# Altium schematic sheet compactv2-5.SchDoc
size A; SheetNumber: 3; SheetTotal: 3
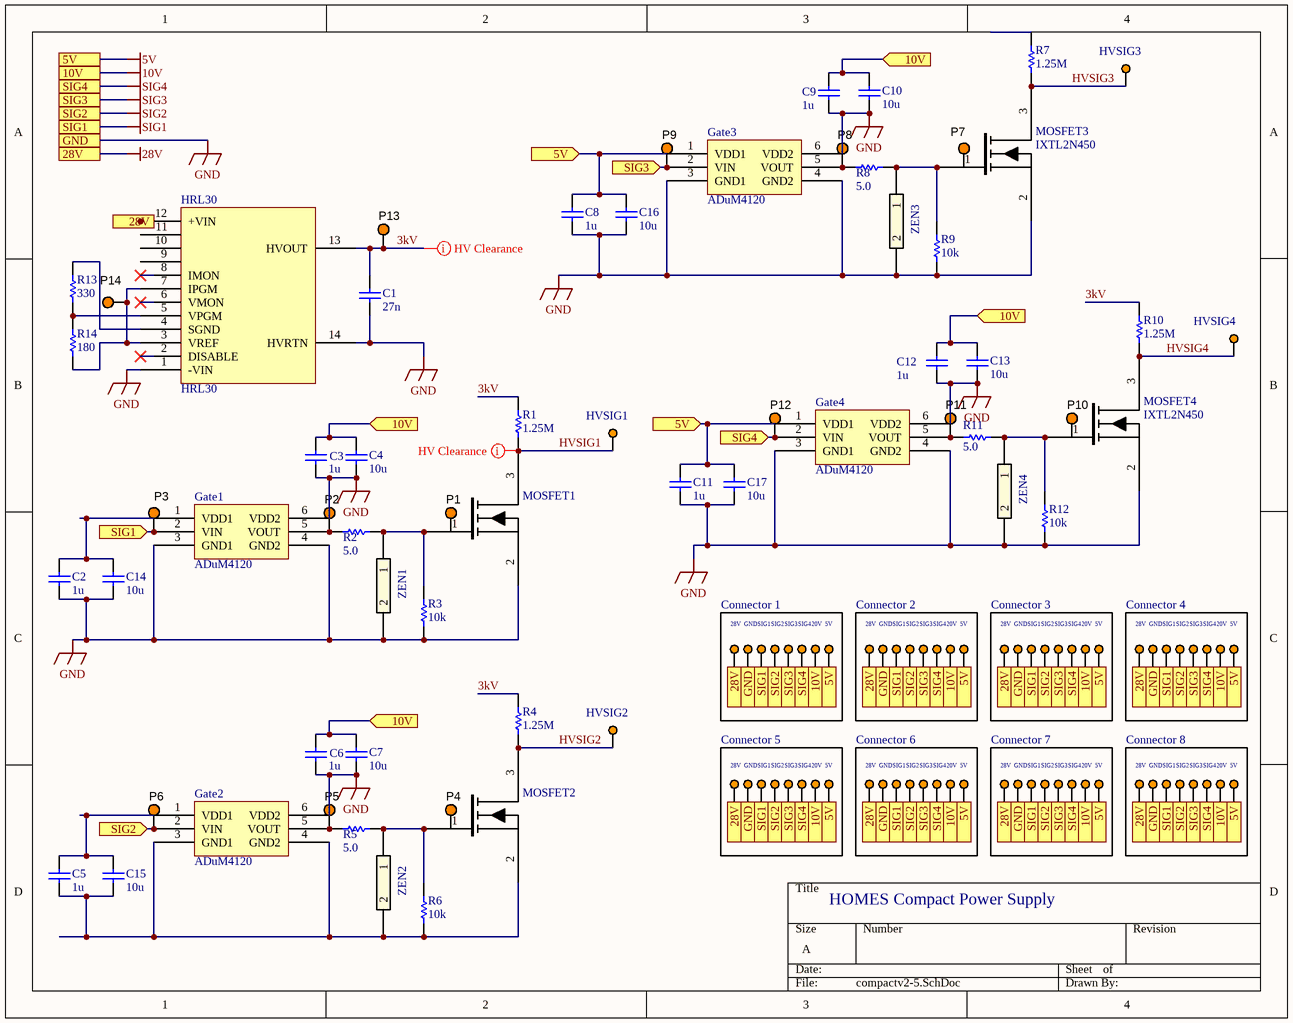
[diagram p0: compactv2-5.SchDoc]

## Parts
(Parts that share a designator on the sheet are numbered #1, #2 ... from top to bottom, then left to right.)
?#1  HVSIG4  [Via]
?#2  HVSIG1  [Via]
?#3  MOSFET1  [MOSFET]
?#4  MOSFET2  [MOSFET]
C1  27n  [HV Capacitor]
C2  1u  [1uF Ceramic Capacitor]
C3  1u  [1uF Ceramic Capacitor]
C4  10u  [10uF Ceramic Capacitor]
C5  1u  [1uF Ceramic Capacitor]
C6  1u  [1uF Ceramic Capacitor]
C7  10u  [10uF Ceramic Capacitor]
C8  1u  [1uF Ceramic Capacitor]
C9  1u  [1uF Ceramic Capacitor]
C10  10u  [10uF Ceramic Capacitor]
C11  1u  [1uF Ceramic Capacitor]
C12  1u  [1uF Ceramic Capacitor]
C13  10u  [10uF Ceramic Capacitor]
C14  10u  [10uF Ceramic Capacitor]
C15  10u  [10uF Ceramic Capacitor]
C16  10u  [10uF Ceramic Capacitor]
C17  10u  [10uF Ceramic Capacitor]
Gate1  ADuM4120  [Gate Driver]
Gate2  ADuM4120  [Gate Driver]
Gate3  ADuM4120  [Gate Driver]
Gate4  ADuM4120  [Gate Driver]
HRL30  HRL30  [Step Up Converter]
MOSFET3  IXTL2N450  [MOSFET]
MOSFET4  IXTL2N450  [MOSFET]
P1  5003  [KSTN-5003]  (value not drawn)
P2  5003  [KSTN-5003]  (value not drawn)
P3  5003  [KSTN-5003]  (value not drawn)
P4  5003  [KSTN-5003]  (value not drawn)
P5  5003  [KSTN-5003]  (value not drawn)
P6  5003  [KSTN-5003]  (value not drawn)
P7  5003  [KSTN-5003]  (value not drawn)
P8  5003  [KSTN-5003]  (value not drawn)
P9  5003  [KSTN-5003]  (value not drawn)
P10  5003  [KSTN-5003]  (value not drawn)
P11  5003  [KSTN-5003]  (value not drawn)
P12  5003  [KSTN-5003]  (value not drawn)
P13  5003  [KSTN-5003]  (value not drawn)
P14  5003  [KSTN-5003]  (value not drawn)
P?#1  HVSIG3  [Via]
P?#2  28V  [Via]
P?#3  GND  [Via]
P?#4  SIG1  [Via]
P?#5  SIG2  [Via]
P?#6  SIG3  [Via]
P?#7  SIG4  [Via]
P?#8  20V  [Via]
P?#9  5V  [Via]
P?#10  28V  [Via]
P?#11  GND  [Via]
P?#12  SIG1  [Via]
P?#13  SIG2  [Via]
P?#14  SIG3  [Via]
P?#15  SIG4  [Via]
P?#16  20V  [Via]
P?#17  5V  [Via]
P?#18  28V  [Via]
P?#19  GND  [Via]
P?#20  SIG1  [Via]
P?#21  SIG2  [Via]
P?#22  SIG3  [Via]
P?#23  SIG4  [Via]
P?#24  20V  [Via]
P?#25  5V  [Via]
P?#26  28V  [Via]
P?#27  GND  [Via]
P?#28  SIG1  [Via]
P?#29  SIG2  [Via]
P?#30  SIG3  [Via]
P?#31  SIG4  [Via]
P?#32  20V  [Via]
P?#33  5V  [Via]
P?#34  HVSIG2  [Via]
P?#35  28V  [Via]
P?#36  GND  [Via]
P?#37  SIG1  [Via]
P?#38  SIG2  [Via]
P?#39  SIG3  [Via]
P?#40  SIG4  [Via]
P?#41  20V  [Via]
P?#42  5V  [Via]
P?#43  28V  [Via]
P?#44  GND  [Via]
P?#45  SIG1  [Via]
P?#46  SIG2  [Via]
P?#47  SIG3  [Via]
P?#48  SIG4  [Via]
P?#49  20V  [Via]
P?#50  5V  [Via]
P?#51  28V  [Via]
P?#52  GND  [Via]
P?#53  SIG1  [Via]
P?#54  SIG2  [Via]
P?#55  SIG3  [Via]
P?#56  SIG4  [Via]
P?#57  20V  [Via]
P?#58  5V  [Via]
P?#59  28V  [Via]
P?#60  GND  [Via]
P?#61  SIG1  [Via]
P?#62  SIG2  [Via]
P?#63  SIG3  [Via]
P?#64  SIG4  [Via]
P?#65  20V  [Via]
P?#66  5V  [Via]
R1  1.25M  [LV Resistor]
R2  5.0  [Zener Resistor]
R3  10k  [LV Resistor]
R4  1.25M  [LV Resistor]
R5  5.0  [Zener Resistor]
R6  10k  [LV Resistor]
R7  1.25M  [LV Resistor]
R8  5.0  [Zener Resistor]
R9  10k  [LV Resistor]
R10  1.25M  [LV Resistor]
R11  5.0  [Zener Resistor]
R12  10k  [LV Resistor]
R13  330  [LV Resistor]
R14  180  [LV Resistor]
ZEN1  (no value)  [Zener Diode]
ZEN2  KDZVTR16B  [Zener Diode]  (value not drawn)
ZEN3  KDZVTR16B  [Zener Diode]  (value not drawn)
ZEN4  KDZVTR16B  [Zener Diode]  (value not drawn)

## Blocks framed on the sheet
Connector 1: P?#2-P?#9
Connector 2: P?#10-P?#17
Connector 3: P?#18-P?#25
Connector 4: P?#26-P?#33
Connector 5: P?#35-P?#42
Connector 6: P?#43-P?#50
Connector 7: P?#51-P?#58
Connector 8: P?#59-P?#66

## Ports
5V, 5V (in), 10V, 10V (in), 28V, GND, SIG1, SIG1 (in), SIG2, SIG2 (in), SIG3, SIG3 (in), SIG4, SIG4 (in)

## Nets
5V: C8.2 C11.2 C16.2 C17.2 Gate3.1(VDD1) Gate4.1(VDD1) ; port 5V
10V: C3.2 C4.2 C6.2 C7.2 C9.2 C10.2 C12.2 C13.2 ; port 10V
28V: port 28V
GND: ?#3.2(S) C1.1 C2.1 C3.1 C4.1 C6.1 C7.1 C8.1 C9.1 C10.1 C11.1 C12.1 C13.1 C14.1 C16.1 C17.1 Gate1.3(GND1) Gate1.4(GND2) Gate1.6(VDD2) Gate2.6(VDD2) Gate3.3(GND1) Gate3.4(GND2) Gate3.6(VDD2) Gate4.3(GND1) Gate4.4(GND2) Gate4.6(VDD2) HRL30.1(-VIN) HRL30.14(HVRTN) MOSFET3.2(S) MOSFET4.2(S) R3.1 R9.1 R12.1 ZEN1.2 ZEN3.2 ZEN4.2 ; port GND
SIG1: Gate1.2(VIN) P3.1 ; port SIG1
SIG2: Gate2.2(VIN) P6.1 ; port SIG2
SIG3: Gate3.2(VIN) P9.1 ; port SIG3
SIG4: Gate4.2(VIN) P12.1 ; port SIG4
3kV: C1.2 HRL30.13(HVOUT) P13.1 R1.1 R4.1 R10.1
HVSIG1: ?#3.3(D) R1.2
HVSIG2: ?#4.3(D) R4.2
HVSIG3: MOSFET3.3(D) R7.2
HVSIG4: MOSFET4.3(D) R10.2
Net?#3_1: ?#3.1(G) R2.1 R3.2 ZEN1.1
Net?#4_1: ?#4.1(G) R5.1 R6.2 ZEN2.1
Net?#4_2: ?#4.2(S) C5.1 C15.1 Gate2.3(GND1) Gate2.4(GND2) R6.1 ZEN2.2
NetC2_2: C2.2 C14.2 Gate1.1(VDD1)
NetC5_2: C5.2 C15.2 Gate2.1(VDD1)
NetGate1_5: Gate1.5(VOUT) P2.1 R2.2
NetGate2_5: Gate2.5(VOUT) P5.1 R5.2
NetGate3_5: Gate3.5(VOUT) P8.1 R8.2
NetGate4_5: Gate4.5(VOUT) P11.1 R11.2
NetHRL30_3: HRL30.3(VREF) HRL30.7(IPGM) P14.1 R14.2
NetHRL30_4: HRL30.4(SGND) R13.1
NetHRL30_5: HRL30.5(VPGM) R13.2 R14.1
NetMOSFET3_1: MOSFET3.1(G) R8.1 R9.2 ZEN3.1
NetMOSFET4_1: MOSFET4.1(G) R11.1 R12.2 ZEN4.1

Not connected (* = marked no-connect by the designer): ?#1 1; ?#2 1; HRL30 2(DISABLE)* 6(VMON)* 8(IMON)* 9 10 11 12(+VIN); P1 1; P4 1; P7 1; P10 1; P?#1 1; P?#2 1; P?#3 1; P?#4 1; P?#5 1; P?#6 1; P?#7 1; P?#8 1; P?#9 1; P?#10 1; P?#11 1; P?#12 1; P?#13 1; P?#14 1; P?#15 1; P?#16 1; P?#17 1; P?#18 1; P?#19 1; P?#20 1; P?#21 1; P?#22 1; P?#23 1; P?#24 1; P?#25 1; P?#26 1; P?#27 1; P?#28 1; P?#29 1; P?#30 1; P?#31 1; P?#32 1; P?#33 1; P?#34 1; P?#35 1; P?#36 1; P?#37 1; P?#38 1; P?#39 1; P?#40 1; P?#41 1; P?#42 1; P?#43 1; P?#44 1; P?#45 1; P?#46 1; P?#47 1; P?#48 1; P?#49 1; P?#50 1; P?#51 1; P?#52 1; P?#53 1; P?#54 1; P?#55 1; P?#56 1; P?#57 1; P?#58 1; P?#59 1; P?#60 1; P?#61 1; P?#62 1; P?#63 1; P?#64 1; P?#65 1; P?#66 1; R7 1

## Layout directives
rule Clearance Constraint [Generic clearance = 10mil, and 26 value(s) for objects]: 3kV, HVSIG1

## Notes on the sheet
- HOMES Compact Power Supply

## Library data of the parts
?#1 ?#2 P?#1-P?#66 = Output Point: Thru hole via
?#3 ?#4 MOSFET3 MOSFET4 = MOSFET: IXTL2N4X0
C1-C17 = Capacitor
Gate1-Gate4 = Gate Driver
HRL30 = Step Up Converter
P1-P14 = CMP-002-00037-2: Test Point, Orange, Height 4.6 mm, Tail Length 3 mm, 1-Pin THD, RoHS; Manufacturer: Keystone; Colour: Orange; Packaging: Bulk; Package Description: 1-Pin Through Hole Device, Dia 2.54 mm; Pins: 1; Package Reference: 5003; Datasheet Version: Jun-15; Case/Package: 5003; Mounting Technology: TH; Connector Type: TestPoint; Diameter: 2.54mm; Contact Material: Bronze; Datasheet URL: http://keyelco.com/userAssets/file/M65p56.pdf; Manufacturer URL: http://www.keyelco.com/; Package Quantity: 10; Contact Plating: Tin; RoHS Compliant: True
R1-R14 = Resistor
ZEN1 = Zener Diode: Manufacturer_Part_Number: KDZVTR16B; Vendor: ROHM Semiconductor; Built_By: EMA_Matt; SourceLibrary: Rohm_2019-09-23; Copyright: Copyright (C) 2018 Accelerated Designs. All rights reserved; RefDes: RefDes; Type: DEV
ZEN2-ZEN4 = Zener Diode: Vendor: ROHM Semiconductor; Built_By: EMA_Matt; SourceLibrary: Rohm_2019-09-23; Manufacturer_Part_Number: KDZVTR16B; Copyright: Copyright (C) 2018 Accelerated Designs. All rights reserved; RefDes: RefDes; Type: DEV